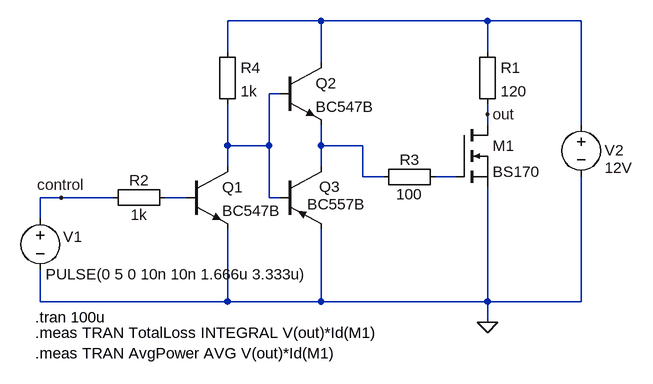
[diagram p0: schematic MOSFET_Switch_totem.asc]
MOSFET_Switch_totem.asc, the LTspice schematic file:
Version 4.1
SHEET 1 1292 680
WIRE -944 -336 -1088 -336
WIRE -688 -336 -944 -336
WIRE -544 -336 -688 -336
WIRE -1088 -288 -1088 -336
WIRE -688 -288 -688 -336
WIRE -944 -272 -944 -336
WIRE -1008 -224 -1024 -224
WIRE -688 -192 -688 -208
WIRE -688 -176 -688 -192
WIRE -544 -176 -544 -336
WIRE -1088 -144 -1088 -208
WIRE -1024 -144 -1024 -224
WIRE -1024 -144 -1088 -144
WIRE -944 -144 -944 -176
WIRE -880 -144 -944 -144
WIRE -1088 -112 -1088 -144
WIRE -944 -112 -944 -144
WIRE -880 -96 -880 -144
WIRE -848 -96 -880 -96
WIRE -736 -96 -768 -96
WIRE -1344 -64 -1376 -64
WIRE -1264 -64 -1344 -64
WIRE -1152 -64 -1184 -64
WIRE -1024 -64 -1024 -144
WIRE -1008 -64 -1024 -64
WIRE -1376 -32 -1376 -64
WIRE -1376 96 -1376 48
WIRE -1088 96 -1088 -16
WIRE -1088 96 -1376 96
WIRE -944 96 -944 -16
WIRE -944 96 -1088 96
WIRE -688 96 -688 -80
WIRE -688 96 -944 96
WIRE -544 96 -544 -96
WIRE -544 96 -688 96
WIRE -688 128 -688 96
FLAG -688 128 0
FLAG -1344 -64 control
FLAG -688 -192 out
SYMBOL voltage -544 -192 R0
WINDOW 123 0 0 Left 2
WINDOW 39 37 60 Left 2
WINDOW 0 36 55 Left 2
WINDOW 3 36 82 Left 2
SYMATTR InstName V2
SYMATTR Value 12V
SYMBOL voltage -1376 -48 R0
WINDOW 123 0 0 Left 2
WINDOW 3 8 102 Left 2
WINDOW 0 35 44 Left 2
WINDOW 39 -81 178 Left 2
SYMATTR Value PULSE(0 5 0 10n 10n 1.666u 3.333u)
SYMATTR InstName V1
SYMBOL nmos -736 -176 R0
SYMATTR InstName M1
SYMATTR Value BS170
SYMBOL Misc\\EuropeanResistor -704 -304 R0
SYMATTR InstName R1
SYMATTR Value 120
SYMBOL Misc\\EuropeanResistor -752 -112 R90
WINDOW 0 5 56 VBottom 2
WINDOW 3 27 56 VTop 2
SYMATTR InstName R3
SYMATTR Value 100
SYMBOL npn -1152 -112 R0
SYMATTR InstName Q1
SYMATTR Value BC547B
SYMBOL Misc\\EuropeanResistor -1168 -80 R90
WINDOW 0 5 56 VBottom 2
WINDOW 3 27 56 VTop 2
SYMATTR InstName R2
SYMATTR Value 1k
SYMBOL Misc\\EuropeanResistor -1104 -304 R0
SYMATTR InstName R4
SYMATTR Value 1k
SYMBOL npn -1008 -272 R0
SYMATTR InstName Q2
SYMATTR Value BC547B
SYMBOL pnp -1008 -112 R0
WINDOW 0 61 31 Left 2
WINDOW 3 43 58 Left 2
SYMATTR InstName Q3
SYMATTR Value BC557B
TEXT -1384 120 Left 2 !.tran 100u
TEXT -1384 144 Left 2 !.meas TRAN TotalLoss INTEGRAL V(out)*Id(M1)\n.meas TRAN AvgPower AVG V(out)*Id(M1)

The netlist it stands for:
* MOSFET_Switch_totem.asc
V2 N001 0 12V
V1 control 0 PULSE(0 5 0 10n 10n 1.666u 3.333u)
M1 out N004 0 0 BS170
R1 N001 out 120
R3 N004 N003 100
Q1 N002 N005 0 0 BC547B
R2 N005 control 1k
R4 N001 N002 1k
Q2 N001 N002 N003 0 BC547B
Q3 N003 N002 0 0 BC557B
.model NPN NPN
.model PNP PNP
.lib standard.bjt
.model NMOS NMOS
.model PMOS PMOS
.lib standard.mos
.tran 100u
.meas TRAN TotalLoss INTEGRAL V(out)*Id(M1)
.meas TRAN AvgPower AVG V(out)*Id(M1)
.backanno
.end